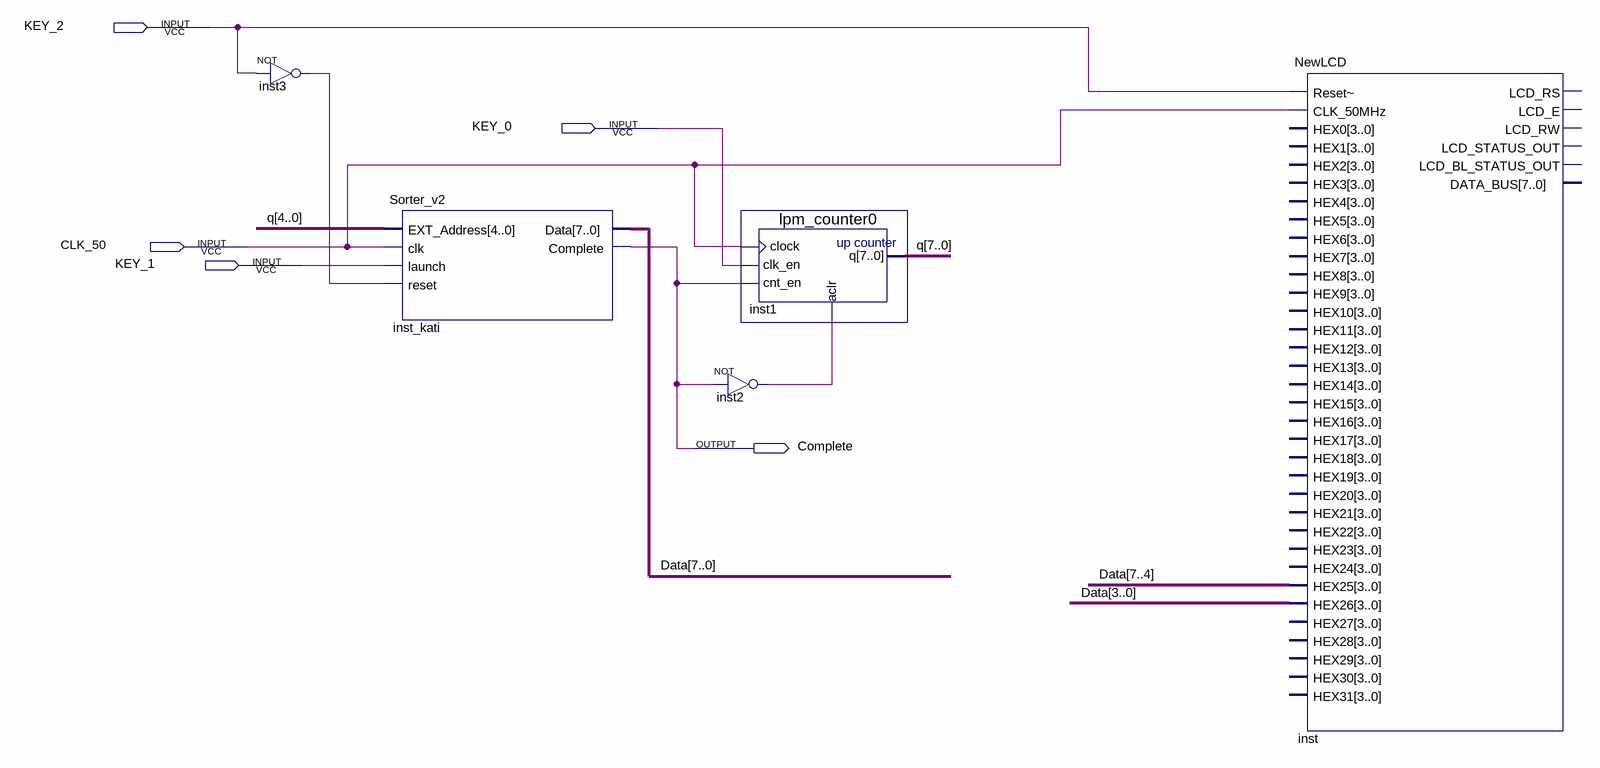
[diagram p0: schematic sheet]
// Quartus schematic final.bdf as structural Verilog: 5 symbols, 5 pins
module \final  (
  input  KEY_2,
  input  KEY_0,
  input  CLK_50,
  input  KEY_1,
  output Complete
);

  wire inst2_out, inst3_out;
  wire [7:0] Data, q;

  not inst3 (inst3_out, KEY_2);
  Sorter_v2 inst_kati (
    .EXT_Address(q[4:0]), .clk(CLK_50), .launch(KEY_1), .reset(inst3_out), .Data(Data), .Complete(Complete));
  lpm_counter0 inst1 (.clock(CLK_50), .clk_en(KEY_0), .cnt_en(Complete), .aclr(inst2_out), .q(q));
  not inst2 (inst2_out, Complete);
  NewLCD inst (
    .\Reset~ (KEY_2), .CLK_50MHz(CLK_50), .HEX25(Data[7:4]), .HEX26(Data[3:0]));  // open: HEX0, HEX1, HEX2, HEX3, HEX4, HEX5, HEX6, HEX7, HEX8, HEX9, HEX10, HEX11, HEX12, HEX13, HEX14, HEX15, HEX16, HEX17, HEX18, HEX19, HEX20, HEX21, HEX22, HEX23, HEX24, HEX27, HEX28, HEX29, HEX30, HEX31, LCD_RS, LCD_E, LCD_RW, LCD_STATUS_OUT, LCD_BL_STATUS_OUT, DATA_BUS
endmodule
